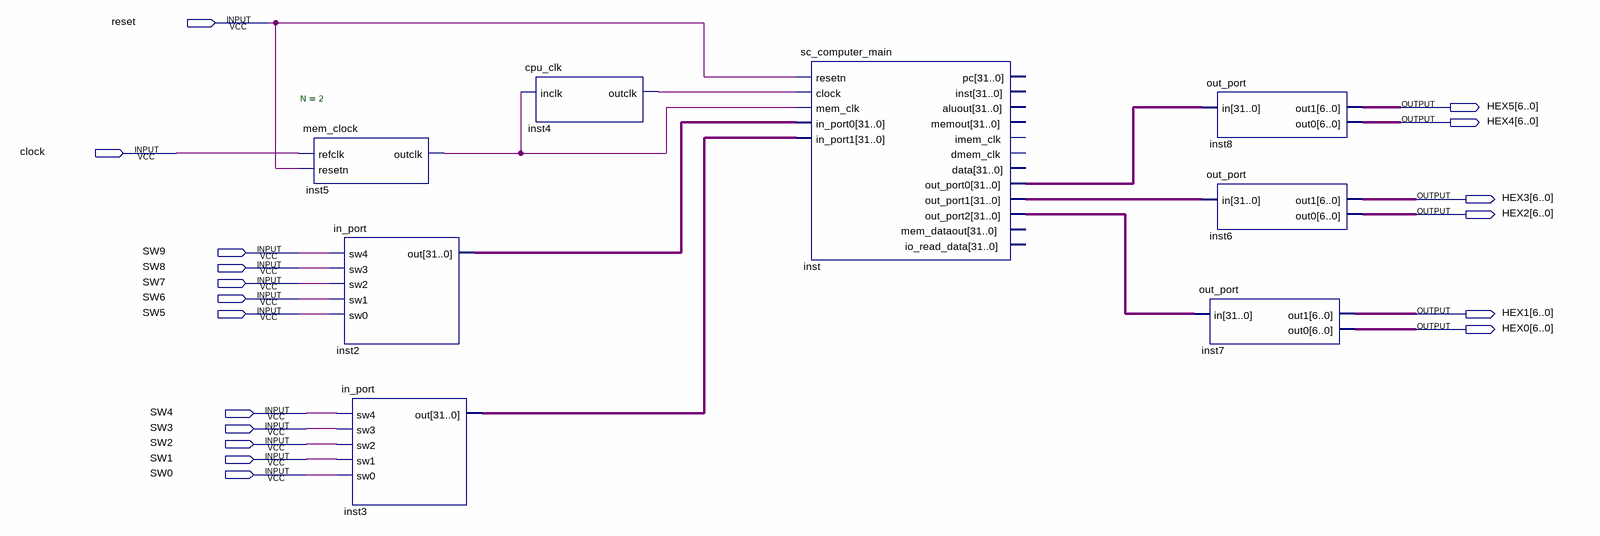
[diagram p0: schematic sheet]
// Quartus schematic sc_computer.bdf as structural Verilog: 8 symbols, 18 pins
module sc_computer (
  input  reset,
  input  clock,
  input  SW9,
  input  SW8,
  input  SW7,
  input  SW6,
  input  SW5,
  input  SW4,
  input  SW3,
  input  SW2,
  input  SW1,
  input  SW0,
  output [6:0] HEX5,
  output [6:0] HEX4,
  output [6:0] HEX3,
  output [6:0] HEX2,
  output [6:0] HEX1,
  output [6:0] HEX0
);

  wire inst4_outclk, inst5_outclk;
  wire [31:0] inst2_out, inst3_out, inst_out_port0, inst_out_port1, inst_out_port2;

  mem_clock #(.N(2)) inst5 (.refclk(clock), .resetn(reset), .outclk(inst5_outclk));
  in_port inst2 (.sw4(SW9), .sw3(SW8), .sw2(SW7), .sw1(SW6), .sw0(SW5), .out(inst2_out));
  in_port inst3 (.sw4(SW4), .sw3(SW3), .sw2(SW2), .sw1(SW1), .sw0(SW0), .out(inst3_out));
  cpu_clk inst4 (.inclk(inst5_outclk), .outclk(inst4_outclk));
  sc_computer_main inst (
    .resetn(reset), .clock(inst4_outclk), .mem_clk(inst5_outclk), .in_port0(inst2_out), .in_port1(inst3_out),
    .out_port0(inst_out_port0), .out_port1(inst_out_port1), .out_port2(inst_out_port2));  // open: pc, inst, aluout, memout, imem_clk, dmem_clk, data, mem_dataout, io_read_data
  out_port inst7 (.in(inst_out_port2), .out1(HEX1), .out0(HEX0));
  out_port inst8 (.in(inst_out_port0), .out1(HEX5), .out0(HEX4));
  out_port inst6 (.in(inst_out_port1), .out1(HEX3), .out0(HEX2));
endmodule
